# EAGLE design Isolate IO v.1 (EAGLE 9.2.0)
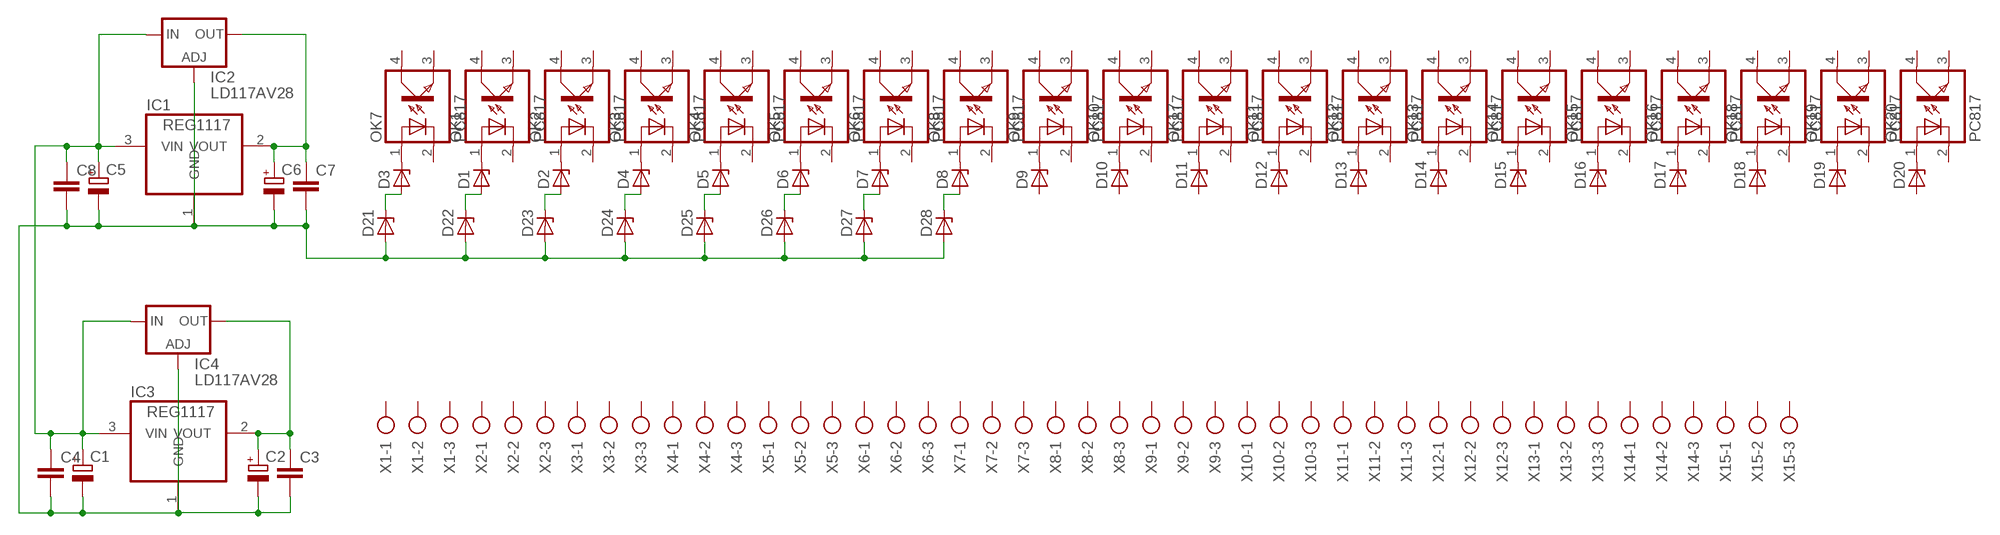
[diagram p0: schematic, sheet 1]

## Parts
C1  CPOL-EUE2.5-5  [E2,5-5]
C2  CPOL-EUE3.5-10  [E3,5-10]
C3  C-EU025-030X050  [C025-030X050]
C4  C-EU025-030X050  [C025-030X050]
C5  CPOL-EUE2.5-5  [E2,5-5]
C6  CPOL-EUE3.5-10  [E3,5-10]
C7  C-EU025-030X050  [C025-030X050]
C8  C-EU025-030X050  [C025-030X050]
D1  ZENER-DIODEZD-2.5  [ZDIO-2.5]
D2  ZENER-DIODEZD-2.5  [ZDIO-2.5]
D3  ZENER-DIODEZD-2.5  [ZDIO-2.5]
D4  ZENER-DIODEZD-2.5  [ZDIO-2.5]
D5  ZENER-DIODEZD-2.5  [ZDIO-2.5]
D6  ZENER-DIODEZD-2.5  [ZDIO-2.5]
D7  ZENER-DIODEZD-2.5  [ZDIO-2.5]
D8  ZENER-DIODEZD-2.5  [ZDIO-2.5]
D9  ZENER-DIODEZD-2.5  [ZDIO-2.5]
D10  ZENER-DIODEZD-2.5  [ZDIO-2.5]
D11  ZENER-DIODEZD-2.5  [ZDIO-2.5]
D12  ZENER-DIODEZD-2.5  [ZDIO-2.5]
D13  ZENER-DIODEZD-2.5  [ZDIO-2.5]
D14  ZENER-DIODEZD-2.5  [ZDIO-2.5]
D15  ZENER-DIODEZD-2.5  [ZDIO-2.5]
D16  ZENER-DIODEZD-2.5  [ZDIO-2.5]
D17  ZENER-DIODEZD-2.5  [ZDIO-2.5]
D18  ZENER-DIODEZD-2.5  [ZDIO-2.5]
D19  ZENER-DIODEZD-2.5  [ZDIO-2.5]
D20  ZENER-DIODEZD-2.5  [ZDIO-2.5]
D21  ZENER-DIODEZD-2.5  [ZDIO-2.5]
D22  ZENER-DIODEZD-2.5  [ZDIO-2.5]
D23  ZENER-DIODEZD-2.5  [ZDIO-2.5]
D24  ZENER-DIODEZD-2.5  [ZDIO-2.5]
D25  ZENER-DIODEZD-2.5  [ZDIO-2.5]
D26  ZENER-DIODEZD-2.5  [ZDIO-2.5]
D27  ZENER-DIODEZD-2.5  [ZDIO-2.5]
D28  ZENER-DIODEZD-2.5  [ZDIO-2.5]
IC1  REG1117  [SOT223]
IC2  LD117AV28  [TO220L1]
IC3  REG1117  [SOT223]
IC4  LD117AV28  [TO220L1]
OK1  PC817  [DIL04]
OK2  PC817  [DIL04]
OK3  PC817  [DIL04]
OK4  PC817  [DIL04]
OK5  PC817  [DIL04]
OK6  PC817  [DIL04]
OK7  PC817  [DIL04]
OK8  PC817  [DIL04]
OK9  PC817  [DIL04]
OK10  PC817  [DIL04]
OK11  PC817  [DIL04]
OK12  PC817  [DIL04]
OK13  PC817  [DIL04]
OK14  PC817  [DIL04]
OK15  PC817  [DIL04]
OK16  PC817  [DIL04]
OK17  PC817  [DIL04]
OK18  PC817  [DIL04]
OK19  PC817  [DIL04]
OK20  PC817  [DIL04]
X1  AK500/3  [AK500/3]
X2  AK500/3  [AK500/3]
X3  AK500/3  [AK500/3]
X4  AK500/3  [AK500/3]
X5  AK500/3  [AK500/3]
X6  AK500/3  [AK500/3]
X7  AK500/3  [AK500/3]
X8  AK500/3  [AK500/3]
X9  AK500/3  [AK500/3]
X10  AK500/3  [AK500/3]
X11  AK500/3  [AK500/3]
X12  AK500/3  [AK500/3]
X13  AK500/3  [AK500/3]
X14  AK500/3  [AK500/3]
X15  AK500/3  [AK500/3]

## Nets
N$1: D3.C OK7.1(A)
N$2: C2.+ C3.1 IC3.2(VOUT) IC4.2(OUT)
N$3: D1.C OK1.1(A)
N$4: C1.- C2.- C3.2 C4.2 C5.- C6.- C7.2 C8.2 D21.A D22.A D23.A D24.A D25.A D26.A D27.A D28.A IC1.1(GND) IC2.1(ADJ) IC3.1(GND) IC4.1(ADJ)
N$5: C6.+ C7.1 IC1.2(VOUT) IC2.2(OUT)
N$6: C1.+ C4.1 C5.+ C8.1 IC1.3(VIN) IC2.3(IN) IC3.3(VIN) IC4.3(IN)
N$7: D2.C OK2.1(A)
N$8: D4.C OK3.1(A)
N$9: D5.C OK4.1(A)
N$10: D6.C OK5.1(A)
N$11: D7.C OK6.1(A)
N$12: D8.C OK8.1(A)
N$13: D9.C OK9.1(A)
N$14: D10.C OK10.1(A)
N$15: D11.C OK17.1(A)
N$16: D12.C OK11.1(A)
N$17: D13.C OK12.1(A)
N$18: D14.C OK13.1(A)
N$19: D15.C OK14.1(A)
N$20: D16.C OK15.1(A)
N$21: D17.C OK16.1(A)
N$22: D18.C OK18.1(A)
N$23: D19.C OK19.1(A)
N$24: D20.C OK20.1(A)
N$25: D3.A D21.C
N$26: D1.A D22.C
N$27: D2.A D23.C
N$28: D4.A D24.C
N$29: D5.A D25.C
N$30: D6.A D26.C
N$31: D7.A D27.C
N$32: D8.A D28.C
Unconnected: D9.A D10.A D11.A D12.A D13.A D14.A D15.A D16.A D17.A D18.A D19.A D20.A OK1.2(C) OK1.3(EMIT) OK1.4(COL) OK2.2(C) OK2.3(EMIT) OK2.4(COL) OK3.2(C) OK3.3(EMIT) OK3.4(COL) OK4.2(C) OK4.3(EMIT) OK4.4(COL) OK5.2(C) OK5.3(EMIT) OK5.4(COL) OK6.2(C) OK6.3(EMIT) OK6.4(COL) OK7.2(C) OK7.3(EMIT) OK7.4(COL) OK8.2(C) OK8.3(EMIT) OK8.4(COL) OK9.2(C) OK9.3(EMIT) OK9.4(COL) OK10.2(C) OK10.3(EMIT) OK10.4(COL) OK11.2(C) OK11.3(EMIT) OK11.4(COL) OK12.2(C) OK12.3(EMIT) OK12.4(COL) OK13.2(C) OK13.3(EMIT) OK13.4(COL) OK14.2(C) OK14.3(EMIT) OK14.4(COL) OK15.2(C) OK15.3(EMIT) OK15.4(COL) OK16.2(C) OK16.3(EMIT) OK16.4(COL) OK17.2(C) OK17.3(EMIT) OK17.4(COL) OK18.2(C) OK18.3(EMIT) OK18.4(COL) OK19.2(C) OK19.3(EMIT) OK19.4(COL) OK20.2(C) OK20.3(EMIT) OK20.4(COL) X1.1 X1.2 X1.3 X2.1 X2.2 X2.3 X3.1 X3.2 X3.3 X4.1 X4.2 X4.3 X5.1 X5.2 X5.3 X6.1 X6.2 X6.3 X7.1 X7.2 X7.3 X8.1 X8.2 X8.3 X9.1 X9.2 X9.3 X10.1 X10.2 X10.3 X11.1 X11.2 X11.3 X12.1 X12.2 X12.3 X13.1 X13.2 X13.3 X14.1 X14.2 X14.3 X15.1 X15.2 X15.3

## Library data of the parts
C1 C2 C5 C6 = rcl:CPOL-EU: POLARIZED CAPACITOR, European symbol; SPICEPREFIX: C
C3 C4 C7 C8 = rcl:C-EU: CAPACITOR, European symbol; SPICEPREFIX: C
D1-D28 = diode:ZENER-DIODE: Z-Diode
IC1 IC3 = burr-brown:REG1117: 800mA and 1A Low Dropout (LDO) Positive Regulator 1.8V, 2.5V, 2.85V, 3.3V, 5V, and Adj; MPN: REG1117; OC_FARNELL: 1097566; OC_NEWARK: 14P6981
IC2 IC4 = v-reg:LD117A?*: Low drop fixed and adjustable positive voltage regulators 1 A Source: http://www.st.com/stonline/products/literature/ds/7194/ld1117axx.pdf
OK1-OK20 = optocoupler:PC817: SHARP OPTO COUPLER; MPN: PC817X4J000F; OC_FARNELL: 9707727; OC_NEWARK: 97K7059
X1-X15 = con-ptr500:AK500/3: CONNECTOR; OC_FARNELL: unknown; OC_NEWARK: unknown

## Board
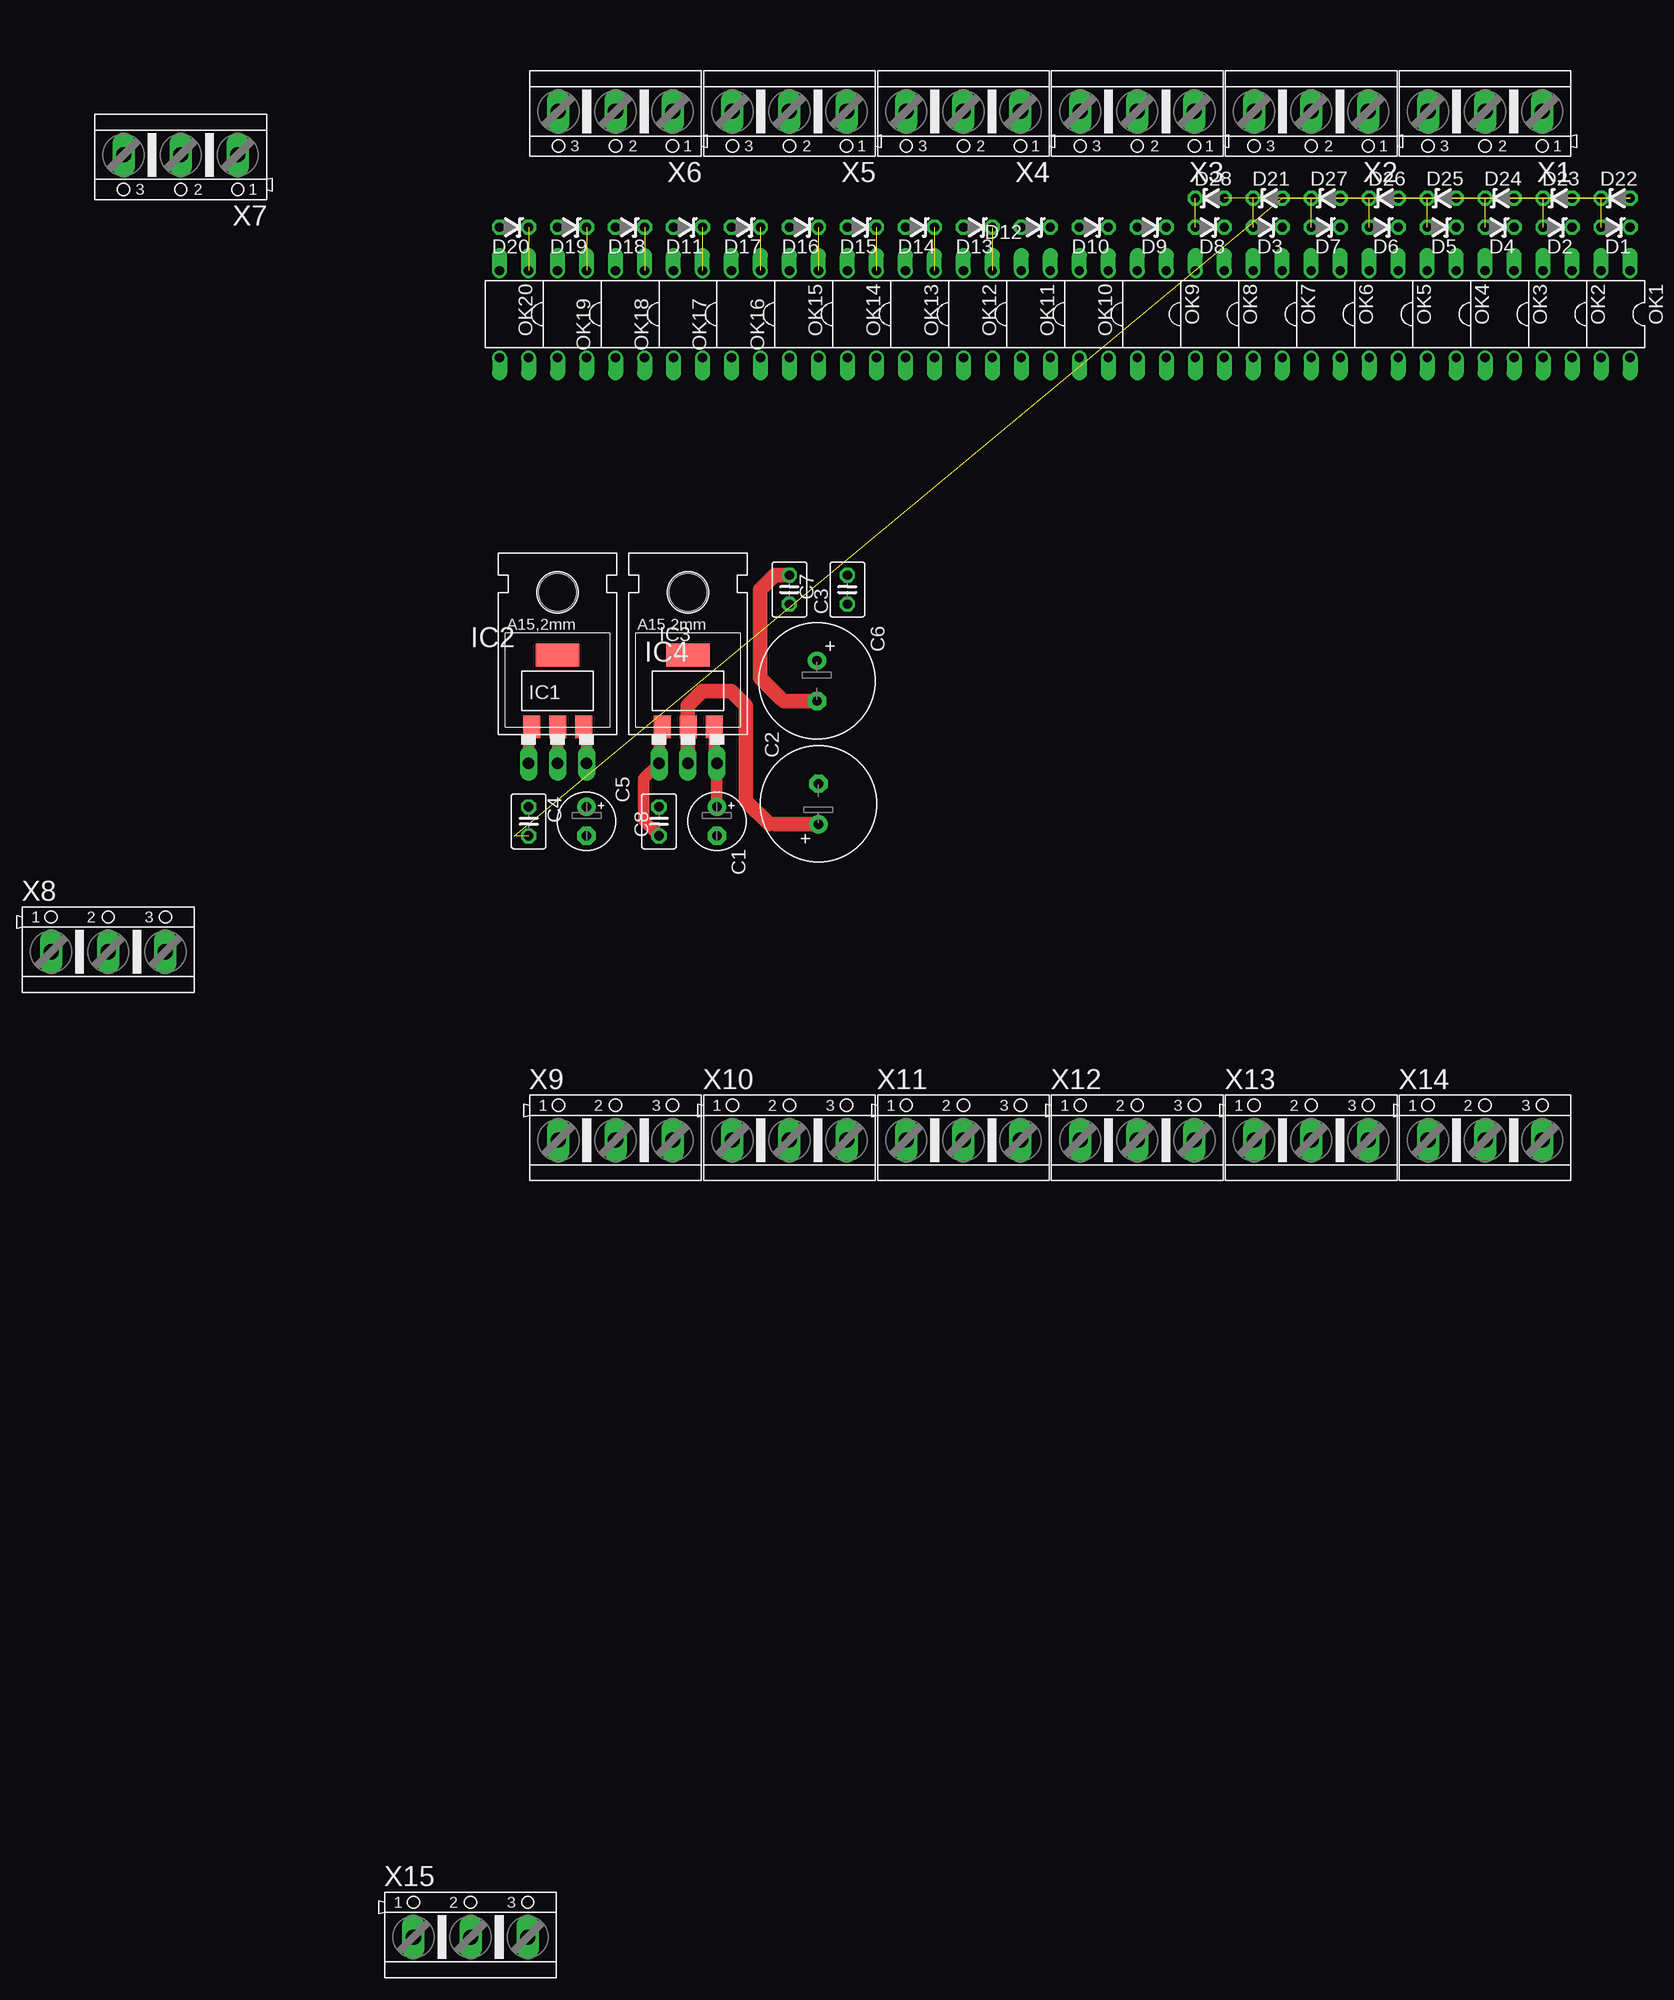
[diagram p1: board, top side]
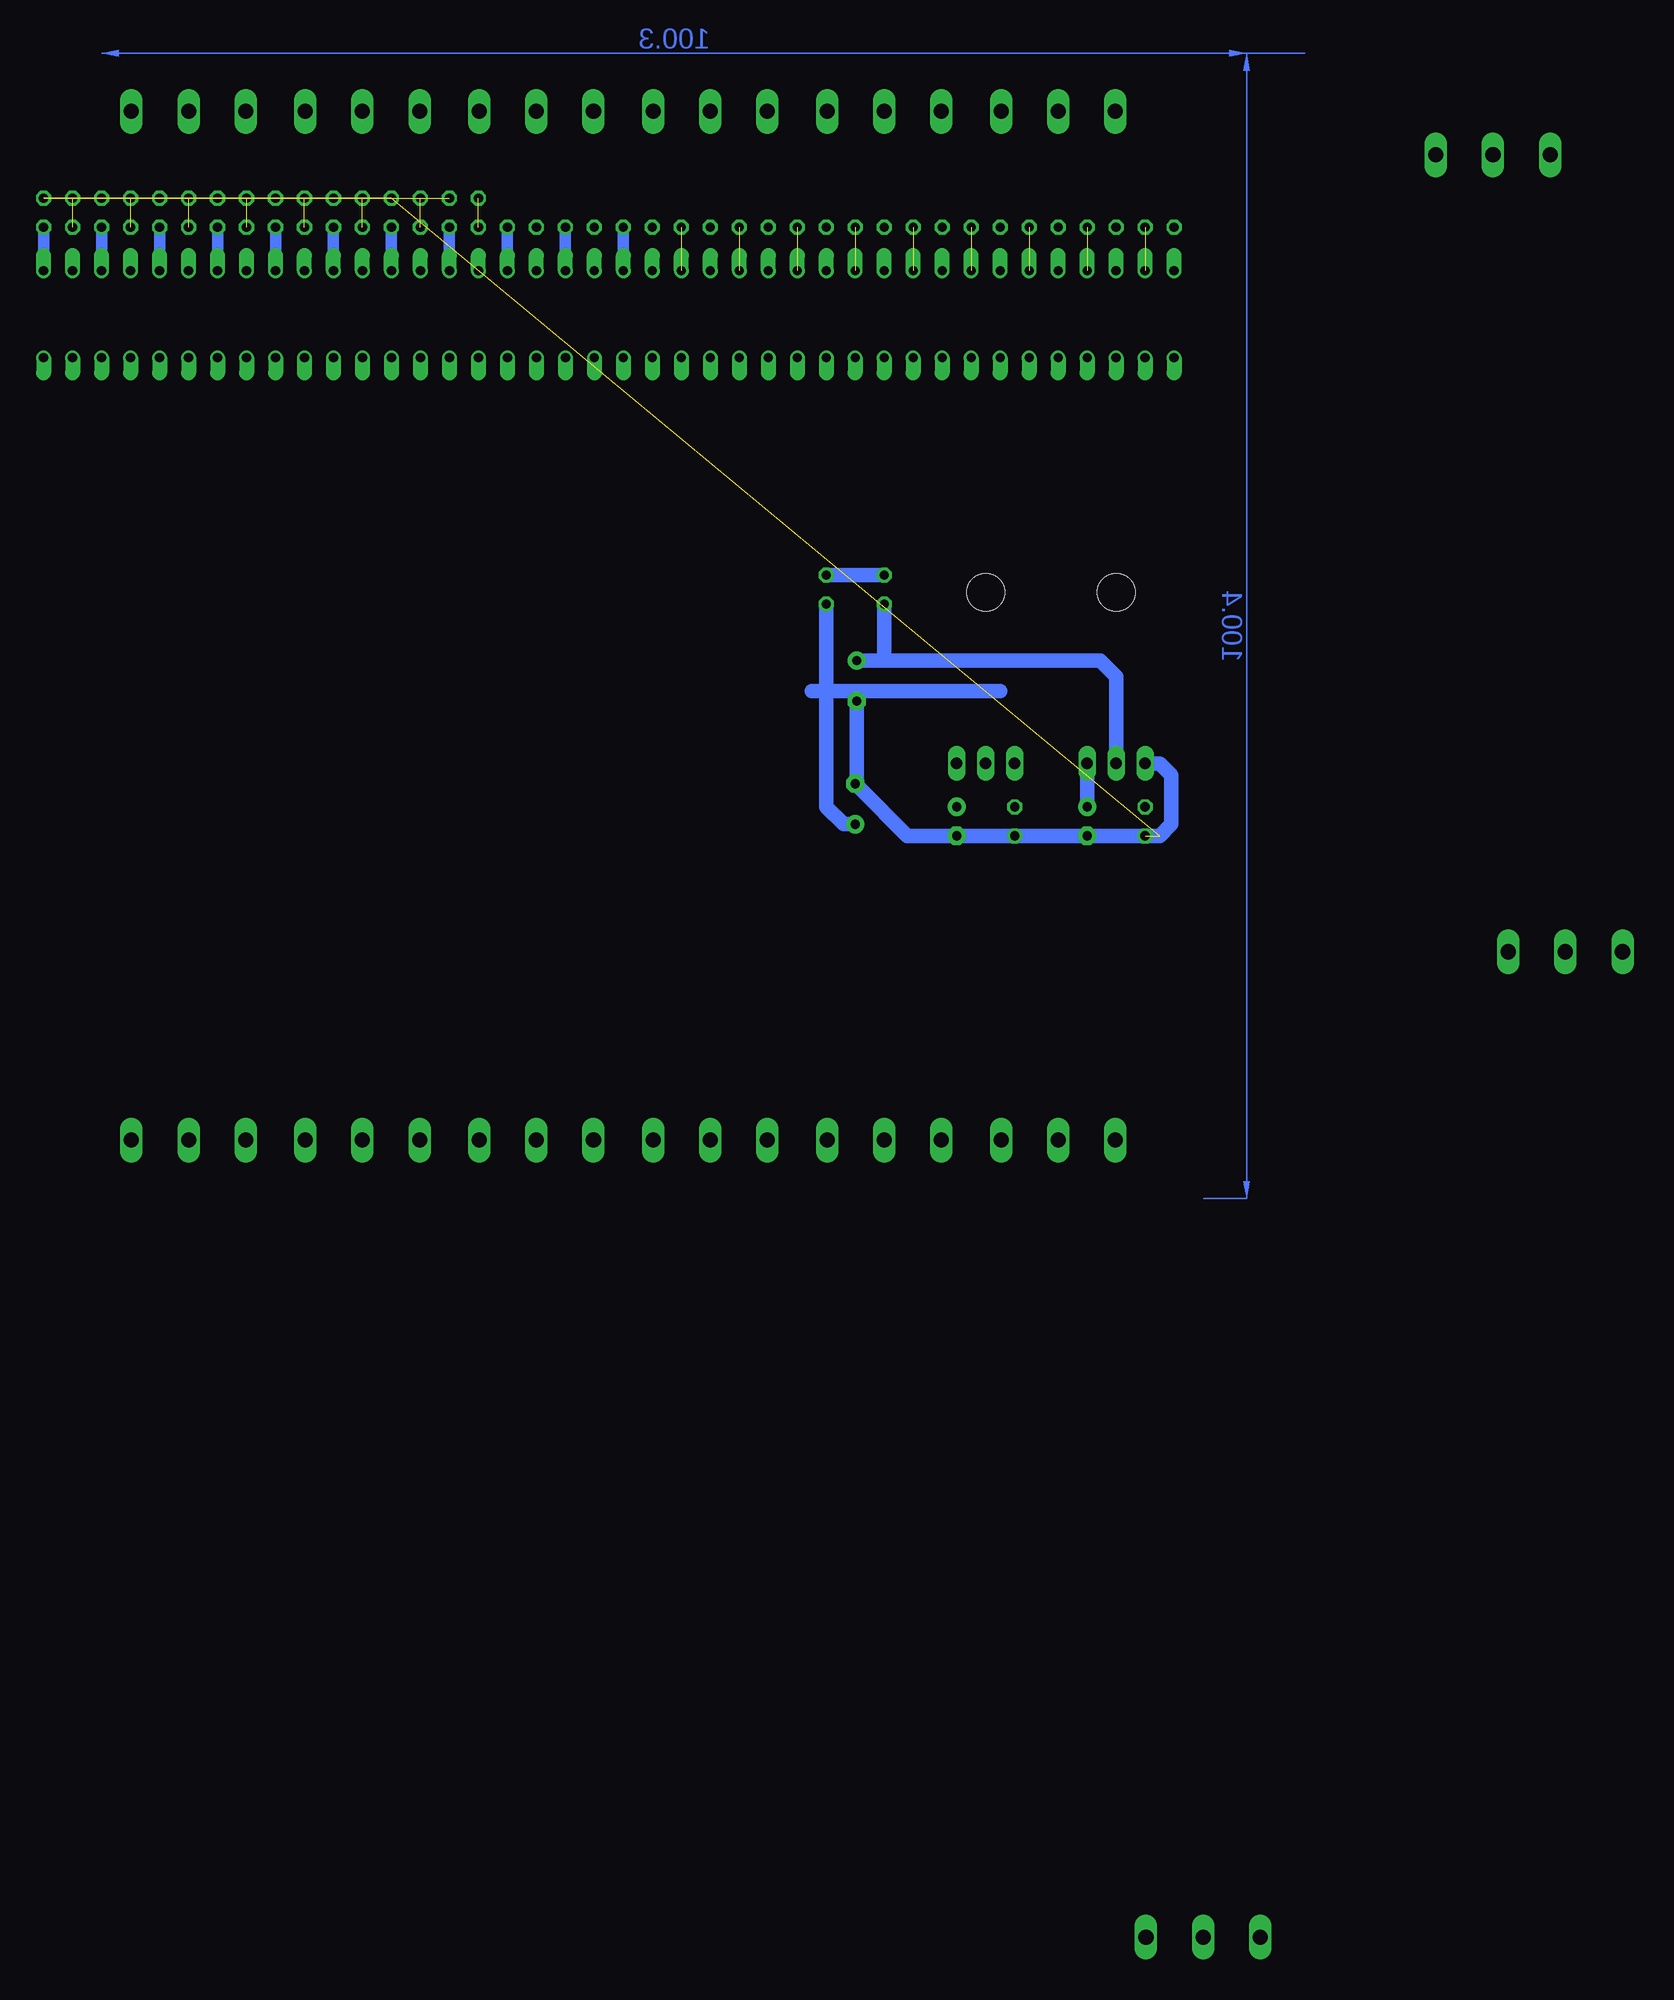
[diagram p2: board, bottom side, seen from below]

No outline drawn. Coordinates in mm, seen from the top.
Copper layers (1*16): Top 0.035mm / dielectric 1.5mm / Bottom 0.035mm
Design rules "default": minimum track width 6mil, minimum drill 0.35mm, track to track 6mil, track to pad 6mil, pad to pad 6mil, via to via 6mil, smd to smd 6mil, copper to edge 40mil, drill to drill 6mil, minimum pad ring 10mil, minimum via ring 8mil, stop-mask expansion 4mil, vias tented up to drill 0mil, thermal gap 10mil

### Footprints (pad centres in the part's own frame; a part is rotated, then mirrored left to right if it is on the bottom)
E2,5-5 = drill 0.813 pad 1.6: + -1.27,0 | drill 0.813 pad 1.6 octagon: - 1.27,0
E3,5-10 = drill 0.813 pad 1.6: + -1.778,0 | drill 0.813 pad 1.6 octagon: - 1.778,0
C025-030X050 = drill 0.813 octagon: 1 -1.27,0; 2 1.27,0
ZDIO-2.5 = drill 0.813 octagon: A 1.27,0; C -1.27,0
SOT223 = smd 1.499 x 2.007: 1 -2.261,-3.15; 2 0.025,-3.15; 3 2.311,-3.15 | smd 3.81 x 2.007: 4 0,3.15
TO220L1 = drill 1.016 long: 1 -2.54,-3.81; 2 0,-3.81; 3 2.54,-3.81 | hole 3.302: 0,11.176
DIL04 = drill 0.813 offset: 1 -1.27,-3.81; 2 1.27,-3.81; 3 1.27,3.81; 4 -1.27,3.81
AK500/3 = drill 1.321 long: 1 -5.004,0; 2 0,0; 3 5.004,0

### Placement (x,y rotation side)
C1  -48.26,-57.15 270 top
C2  -39.37,-55.63 90 top
C3  -36.83,-36.83 90 top
C4  -64.77,-57.15 270 top
C5  -59.69,-57.15 270 top
C6  -39.5,-44.83 270 top
C7  -41.91,-36.83 90 top
C8  -53.34,-57.15 270 top
D1  30.48,-5.08 180 top
D2  25.4,-5.08 180 top
D3  0,-5.08 180 top
D4  20.32,-5.08 180 top
D5  15.24,-5.08 180 top
D6  10.16,-5.08 180 top
D7  5.08,-5.08 180 top
D8  -5.08,-5.08 180 top
D9  -10.16,-5.08 180 top
D10  -15.24,-5.08 180 top
D11  -50.8,-5.08 180 top
D12  -20.32,-5.08 180 top
D13  -25.4,-5.08 180 top
D14  -30.48,-5.08 180 top
D15  -35.56,-5.08 180 top
D16  -40.64,-5.08 180 top
D17  -45.72,-5.08 180 top
D18  -55.88,-5.08 180 top
D19  -60.96,-5.08 180 top
D20  -66.04,-5.08 180 top
D21  0,-2.54 0 top
D22  30.48,-2.54 0 top
D23  25.4,-2.54 0 top
D24  20.32,-2.54 0 top
D25  15.24,-2.54 0 top
D26  10.16,-2.54 0 top
D27  5.08,-2.54 0 top
D28  -5.08,-2.54 0 top
IC1  -62.23,-45.72 0 top
IC2  -62.23,-48.26 0 top
IC3  -50.8,-45.72 0 top
IC4  -50.8,-48.26 0 top
OK1  30.48,-12.7 180 top
OK2  25.4,-12.7 180 top
OK3  20.32,-12.7 180 top
OK4  15.24,-12.7 180 top
OK5  10.16,-12.7 180 top
OK6  5.08,-12.7 180 top
OK7  0,-12.7 180 top
OK8  -5.08,-12.7 180 top
OK9  -10.16,-12.7 180 top
OK10  -15.24,-12.7 180 top
OK11  -20.32,-12.7 180 top
OK12  -25.4,-12.7 180 top
OK13  -30.48,-12.7 180 top
OK14  -35.56,-12.7 180 top
OK15  -40.64,-12.7 180 top
OK16  -45.72,-12.7 180 top
OK17  -50.8,-12.7 180 top
OK18  -55.88,-12.7 180 top
OK19  -60.96,-12.7 180 top
OK20  -66.04,-12.7 180 top
X1  19.05,5.08 180 top
X2  3.81,5.08 180 top
X3  -11.43,5.08 180 top
X4  -26.67,5.08 180 top
X5  -41.91,5.08 180 top
X6  -57.15,5.08 180 top
X7  -95.25,1.27 180 top
X8  -101.6,-68.58 0 top
X9  -57.15,-85.09 0 top
X10  -41.91,-85.09 0 top
X11  -26.67,-85.09 0 top
X12  -11.43,-85.09 0 top
X13  3.81,-85.09 0 top
X14  19.05,-85.09 0 top
X15  -69.85,-154.94 0 top

### Tracks (layer width: path | path; a pad name or v marks a point on that pad's centre or on a via)
N$1
  Bottom 1.016: D3.C OK7.1
N$2
  Top 1.016: IC4.2 -50.77,-52.05 IC3.2 | -43.18,-57.4 -43.69,-57.4
  Top 1.27: IC4.2 -50.8,-46.99 -49.53,-45.72 -46.99,-45.72 -45.72,-46.99 -45.72,-55.37 -43.69,-57.4 | C2.+ -43.18,-57.4
  Bottom 1.27: C2.+ -38.35,-57.4 -36.83,-55.88 C3.1
N$3
  Bottom 1.016: D1.C OK1.1
N$4  (9 unrouted)
  Top 1.016: IC2.1 -64.75,-52.05 -64.75,-49.12 IC1.1 | C8.2 -54.66,-57.1 -54.66,-53.39 IC4.1 -53.34,-49.15 IC3.1 | -42.42,-46.61 -42.61,-46.42
  Top 1.27: C6.- -42.42,-46.61 | -42.61,-46.42 -44.45,-44.58 -44.45,-36.83 -43.18,-35.56 C7.2
  Bottom 1.016: -43.94,-58.42 C1.- C8.2 C5.- -66.04,-58.42 | C2.- -39.75,-54.23
  Bottom 1.27: IC2.1 -66.04,-52.07 -67.06,-53.09 -67.06,-57.4 -66.04,-58.42 -43.94,-58.42 -39.75,-54.23 | C3.2 C7.2 | C2.- -39.5,-53.72 C6.-
N$5
  Top 1.016: IC2.2 -62.2,-52.05 IC1.2
  Bottom 1.016: C6.+ -41.91,-43.05
  Bottom 1.27: IC2.2 -62.23,-44.45 -60.83,-43.05 C6.+ | C7.1 -41.91,-43.05
N$6
  Top 1.016: C1.+ IC4.3 -48.49,-51.84 IC3.3 | IC1.3 -59.69,-49.1 IC2.3
  Bottom 1.016: -40.64,-45.72 -35.56,-45.72
  Bottom 1.27: -52.07,-45.72 -35.56,-45.72 | IC2.3 C5.+
N$7
  Bottom 1.016: D2.C OK2.1
N$8
  Bottom 1.016: D4.C OK3.1
N$9
  Bottom 1.016: D5.C OK4.1
N$10
  Bottom 1.016: D6.C OK5.1
N$11
  Bottom 1.016: D7.C OK6.1
N$12
  Bottom 1.016: D8.C OK8.1
N$13
  Bottom 1.016: D9.C OK9.1
N$14
  Bottom 1.016: D10.C OK10.1
N$15  (1 unrouted)
N$16
  Bottom 1.016: D12.C OK11.1
N$17  (1 unrouted)
N$18  (1 unrouted)
N$19  (1 unrouted)
N$20  (1 unrouted)
N$21  (1 unrouted)
N$22  (1 unrouted)
N$23  (1 unrouted)
N$24  (1 unrouted)
N$25  (1 unrouted)
N$26  (1 unrouted)
N$27  (1 unrouted)
N$28  (1 unrouted)
N$29  (1 unrouted)
N$30  (1 unrouted)
N$31  (1 unrouted)
N$32  (1 unrouted)
(copper drawn outside any net)
  shapes: Bottom area x2